# EAGLE design Qwiic Shield for RaspberryPi (EAGLE 7.5.0)
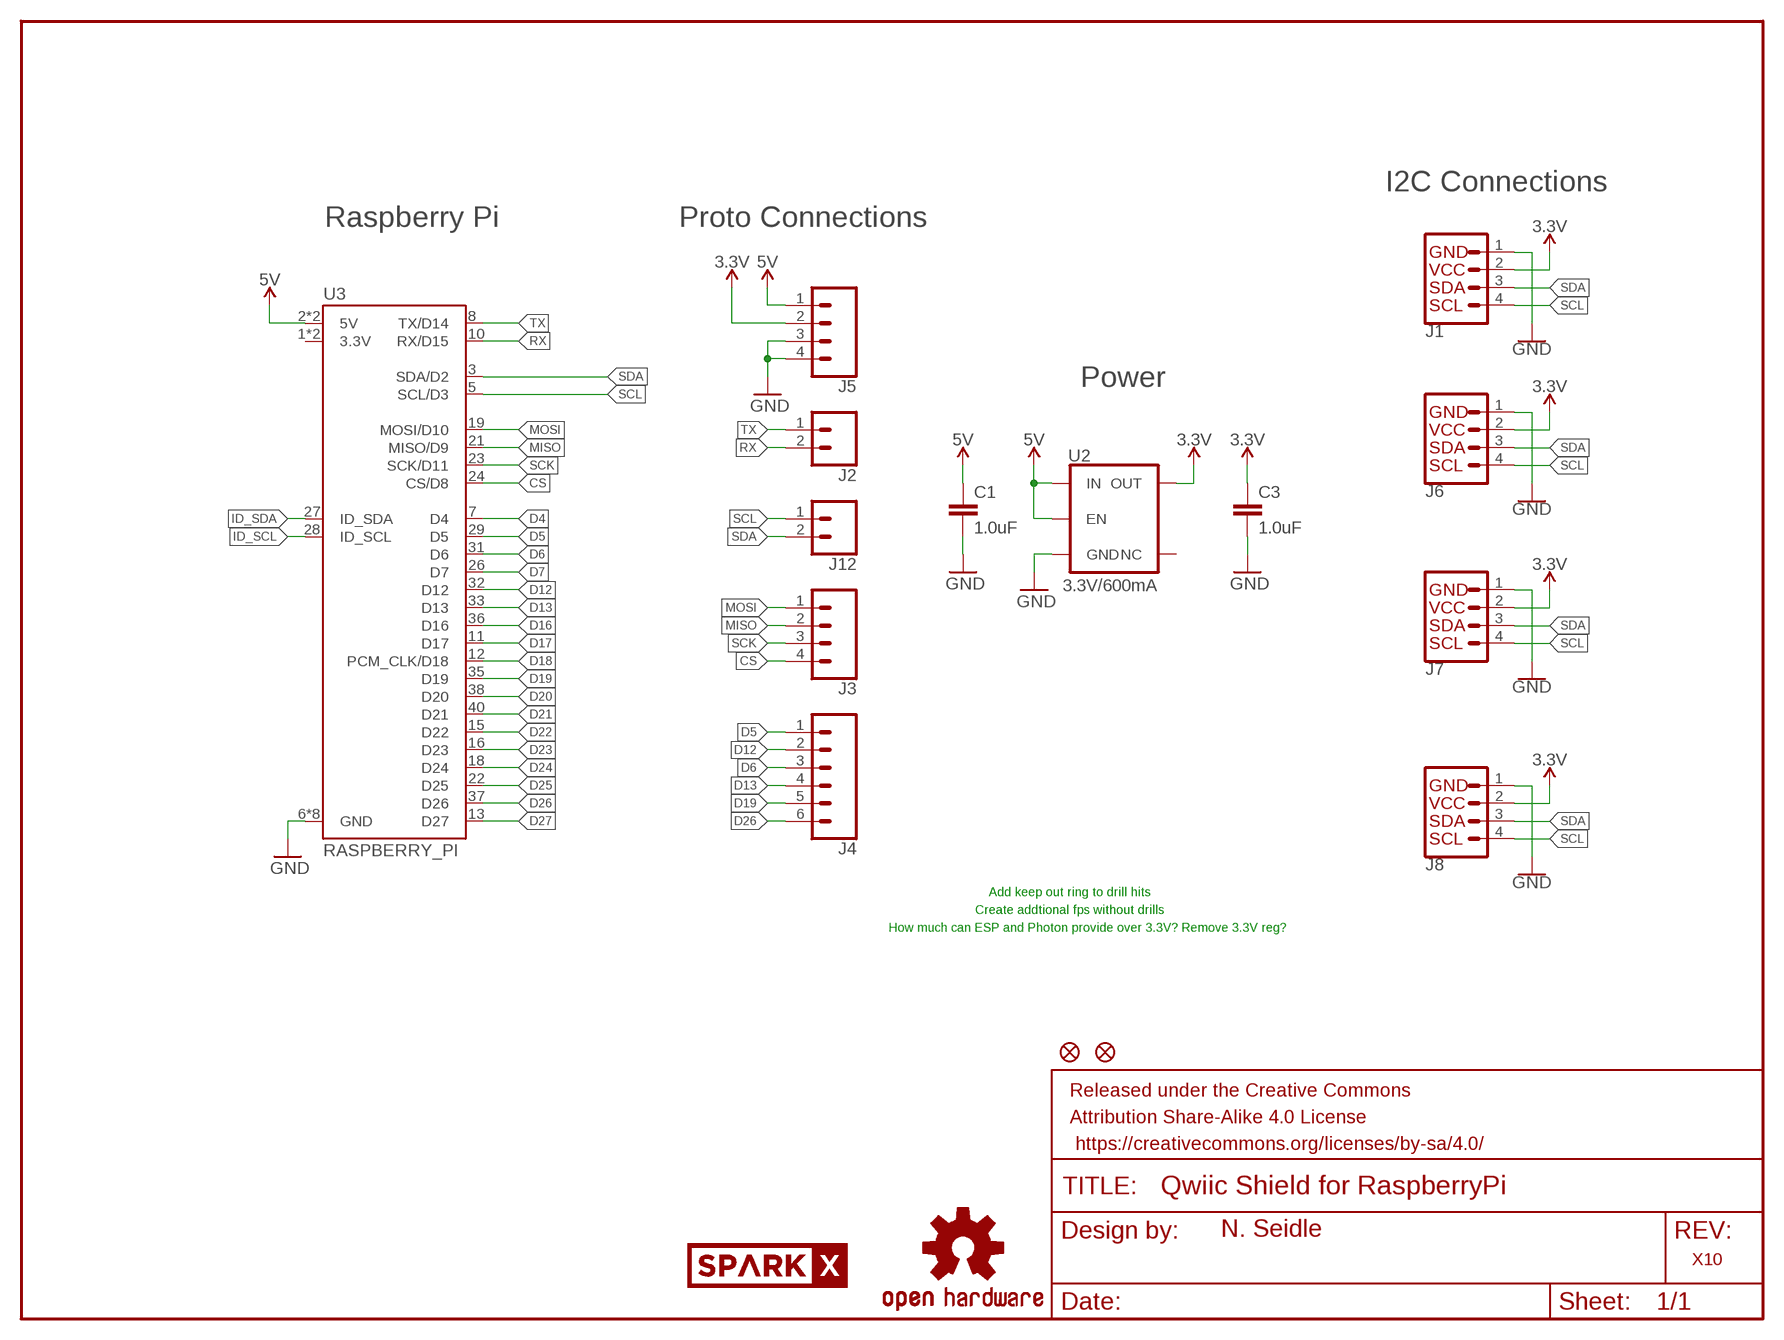
[diagram p0: schematic, sheet 1]

## Parts
C1  1.0uF  1.0UF-0603-16V-10%  [0603]
C3  1.0uF  1.0UF-0603-16V-10%  [0603]
FD1  FIDUCIAL1X2  [FIDUCIAL-1X2]
FD2  FIDUCIAL1X2  [FIDUCIAL-1X2]
FRAME1  FRAME-LETTER  [CREATIVE_COMMONS]
J1  I2C_STANDARDJS-1MM  [1X04_1MM_RA]
J2  CONN_021X02_NO_SILK  [1X02_NO_SILK]
J3  CONN_041X04_NO_SILK  [1X04_NO_SILK]
J4  CONN_06NO_SILK_FEMALE_PTH  [1X06_NO_SILK]
J5  CONN_041X04_NO_SILK  [1X04_NO_SILK]
J6  I2C_STANDARDJS-1MM  [1X04_1MM_RA]
J7  I2C_STANDARDJS-1MM  [1X04_1MM_RA]
J8  I2C_STANDARDJS-1MM  [1X04_1MM_RA]
J12  CONN_021X02_NO_SILK  [1X02_NO_SILK]
LOGO1  OSHW-LOGOMINI  [OSHW-LOGO-MINI]
U2  3.3V/600mA  V_REG_AP2112K-3.3V  [SOT23-5]
U3  RASPBERRY_PI  RASPBERRY_PI_40SMD  [RASPBERRY_PI_SHIELD_HOLES]
U$1  SPARKX-LOGO3  [SPARKX-SMALL]
U$2  SPARKX-LOGO5  [SPARKX-LARGE]

## Nets
3.3V: C3.1 J1.2(VCC) J5.2 J6.2(VCC) J7.2(VCC) J8.2(VCC) U2.5(OUT)
5V: C1.1 J5.1 U2.1(IN) U2.3(EN) U3.2(5V) U3.4(5V)
CS: J3.4 U3.24(CS/D8)
D4: U3.7(D4)
D5: J4.1 U3.29(D5)
D6: J4.3 U3.31(D6)
D7: U3.26(D7)
D12: J4.2 U3.32(D12)
D13: J4.4 U3.33(D13)
D16: U3.36(D16)
D17: U3.11(D17)
D18: U3.12(PCM_CLK/D18)
D19: J4.5 U3.35(D19)
D20: U3.38(D20)
D21: U3.40(D21)
D22: U3.15(D22)
D23: U3.16(D23)
D24: U3.18(D24)
D25: U3.22(D25)
D26: J4.6 U3.37(D26)
D27: U3.13(D27)
GND [vcc]: C1.2 C3.2 J1.1(GND) J5.3 J5.4 J6.1(GND) J7.1(GND) J8.1(GND) U2.2(GND) U3.6(GND) U3.9(GND) U3.14(GND) U3.20(GND) U3.25(GND) U3.30(GND) U3.34(GND) U3.39(GND)
ID_SCL: U3.28(ID_SCL)
ID_SDA: U3.27(ID_SDA)
MISO: J3.2 U3.21(MISO/D9)
MOSI: J3.1 U3.19(MOSI/D10)
RX: J2.2 U3.10(RX/D15)
SCK: J3.3 U3.23(SCK/D11)
SCL: J1.4(SCL) J6.4(SCL) J7.4(SCL) J8.4(SCL) J12.1 U3.5(SCL/D3)
SDA: J1.3(SDA) J6.3(SDA) J7.3(SDA) J8.3(SDA) J12.2 U3.3(SDA/D2)
TX: J2.1 U3.8(TX/D14)
Unconnected: U2.4(NC) U3.1(3.3V) U3.17(3.3V)

## Notes on the sheet
- I2C Connections
- Raspberry Pi | Proto Connections
- Power
- Add keep out ring to drill hits
- Create addtional fps without drills
- How much can ESP and Photon provide over 3.3V? Remove 3.3V reg?
- N. Seidle
- X10

## Library data of the parts
C1 C3 = SparkFun-Capacitors:1.0UF: 1µF ceramic capacitors A capacitor is a passive two-terminal electrical component used to store electrical energy temporarily in an electric field.; PROD_ID: CAP-00868
FD1 FD2 = SparkFun-Aesthetics:FIDUCIAL: Fiducial Alignment Points Various fiducial points for machine vision alignment.
FRAME1 = SparkFun-Aesthetics:FRAME-LETTER: Schematic Frame Standard 8.5x11 US Letter frame
J1 J6-J8 = SparkX:I2C_STANDARD: SparkFun I2C Standard Pinout Header SparkFun has standardized on a pinout for all I2C based sensor breakouts. This pinout allows I2C boards to be plugged directly into the headers on Arduino Uno compatible boards, and to be daisy chained easily. Example SparkFun Products: SparkFun Atmospheric Sensor Breakout - BME280 <https://www.sparkfun.com/products/13676> SparkFun Altitude/Pressure Sensor Breakout - MPL3115A2 <https://www.sparkfun.com/products/11084> SparkFun TOF Range Finder Sensor - VL6180 <https://www.sparkfun.com/products/12785>
J2 J12 = SparkFun-Connectors:CONN_02: Multi connection point. Often used as Generic Header-pin footprint for 0.1 inch spaced/style header connections On any of the 0.1 inch spaced packages, you can populate with these: Break Away Headers - Straight <https://www.sparkfun.com/products/116> (PRT-00116) Break Away Male Headers - Right Angle <https://www.sparkfun.com/products/553> (PRT-00553) Female Headers <https://www.sparkfun.com/products/115> (PRT-00115) Break Away Headers - Machine Pin <https://www.sparkfun.com/products/117> (PRT-00117) Break Away Female Headers - Swiss Machine Pin <https://www.sparkfun.com/products/743> (PRT-00743) For SCREWTERMINALS and SPRING TERMINALS visit here: Screw Terimnals on SparkFun.com <https://www.sparkfun.com/search/results?term=Screw+Terminals> (5mm/3.5mm/2.54mm spacing) This device is also useful as a general connection point to wire up your design to another part of your project. Our various solder wires solder well into these plated through hole pads. Hook-Up Wire - Assortment (Stranded, 22 AWG) <https://www.sparkfun.com/products/11375> (PRT-11375) Hook-Up Wire - Assortment (Solid Core, 22 AWG) <https://www.sparkfun.com/products/11367> (PRT-11367) View the entire wire category on our website here <https://www.sparkfun.com/categories/141> Special notes: Molex polarized connector foot print use with: PRT-08233 with associated crimp pins and housings. 2.54_SCREWTERM for use with PRT-10571. 3.5mm Screw Terminal footprints for PRT-08084 5mm Screw Terminal footprints for use with PRT-08432
J3 J5 = SparkFun-Connectors:CONN_04: Multi connection point. Often used as Generic Header-pin footprint for 0.1 inch spaced/style header connections On any of the 0.1 inch spaced packages, you can populate with these: Break Away Headers - Straight <https://www.sparkfun.com/products/116> (PRT-00116) Break Away Male Headers - Right Angle <https://www.sparkfun.com/products/553> (PRT-00553) Female Headers <https://www.sparkfun.com/products/115> (PRT-00115) Break Away Headers - Machine Pin <https://www.sparkfun.com/products/117> (PRT-00117) Break Away Female Headers - Swiss Machine Pin <https://www.sparkfun.com/products/743> (PRT-00743) For SCREWTERMINALS and SPRING TERMINALS visit here: Screw Terimnals on SparkFun.com <https://www.sparkfun.com/search/results?term=Screw+Terminals> (5mm/3.5mm/2.54mm spacing) This device is also useful as a general connection point to wire up your design to another part of your project. Our various solder wires solder well into these plated through hole pads. Hook-Up Wire - Assortment (Stranded, 22 AWG) <https://www.sparkfun.com/products/11375> (PRT-11375) Hook-Up Wire - Assortment (Solid Core, 22 AWG) <https://www.sparkfun.com/products/11367> (PRT-11367) View the entire wire category on our website here <https://www.sparkfun.com/categories/141> Special notes: Molex polarized connector foot print use with SKU : PRT-08231 with associated crimp pins and housings. 1MM SMD Version SKU: PRT-10208; PROD_ID: CONN-09696
J4 = SparkFun-Connectors:CONN_06: Multi connection point. Often used as Generic Header-pin footprint for 0.1 inch spaced/style header connections On any of the 0.1 inch spaced packages, you can populate with these: Break Away Headers - Straight <https://www.sparkfun.com/products/116> (PRT-00116) Break Away Male Headers - Right Angle <https://www.sparkfun.com/products/553> (PRT-00553) Female Headers <https://www.sparkfun.com/products/115> (PRT-00115) Break Away Headers - Machine Pin <https://www.sparkfun.com/products/117> (PRT-00117) Break Away Female Headers - Swiss Machine Pin <https://www.sparkfun.com/products/743> (PRT-00743) Arduino Stackable Header - 6 Pin <https://www.sparkfun.com/products/9280> (PRT-09280) For SCREWTERMINALS and SPRING TERMINALS visit here: Screw Terimnals on SparkFun.com <https://www.sparkfun.com/search/results?term=Screw+Terminals> (5mm/3.5mm/2.54mm spacing) This device is also useful as a general connection point to wire up your design to another part of your project. Our various solder wires solder well into these plated through hole pads. Hook-Up Wire - Assortment (Stranded, 22 AWG) <https://www.sparkfun.com/products/11375> (PRT-11375) Hook-Up Wire - Assortment (Solid Core, 22 AWG) <https://www.sparkfun.com/products/11367> (PRT-11367) View the entire wire category on our website here <https://www.sparkfun.com/categories/141>; PROD_ID: CONN-08437
LOGO1 = SparkFun-Aesthetics:OSHW-LOGO: Open Source Hardware Logo This logo indicates the piece of hardware it is found on incorporates a OSHW license and/or adheres to the definition of open source hardware found here: http://freedomdefined.org/OSHW
U2 = SparkFun-IC-Power:V_REG_AP2112: AP2112 - 600mA CMOS LDO Regulator w/ Enable The AP2112 is CMOS process low dropout linear regulator with enable function, the regulator delivers a guaranteed 600mA (min.) continuous load current. Features Output Voltage Accuracy: ±1.5% Output Current: 600mA (Min.) Foldback Short Current Protection: 50mA Enable Function to Turn ON/OFF VOUT Low Dropout Voltage (3.3V): 250mV (Typ.) @IOUT=600mA Excellent Load Regulation: 0.2%/A (Typ.) Excellent Line Regulation: 0.02%/V (Typ.) Low Quiescent Current: 55μA (Typ.) Low Standby Current: 0.01μA (Typ.) Low Output Noise: 50μVRMS PSRR: 100Hz -65dB, 1kHz -65dB OTSD Protection Stable with 1.0μF Flexible Cap: Ceramic, Tantalum and Aluminum Electrolytic Operation Temperature Range: -40°C to 85°C ESD: MM 400V, HBM 4000V; PROD_ID: VREG-12457; VALUE: 3.3V
U3 = SparkX:RASPBERRY_PI_40
U$1 U$2 = SparkX:SPARKX-LOGO

## Net classes
0 Default: width 0.178 mm
1 vcc: width 0.178 mm

## Board
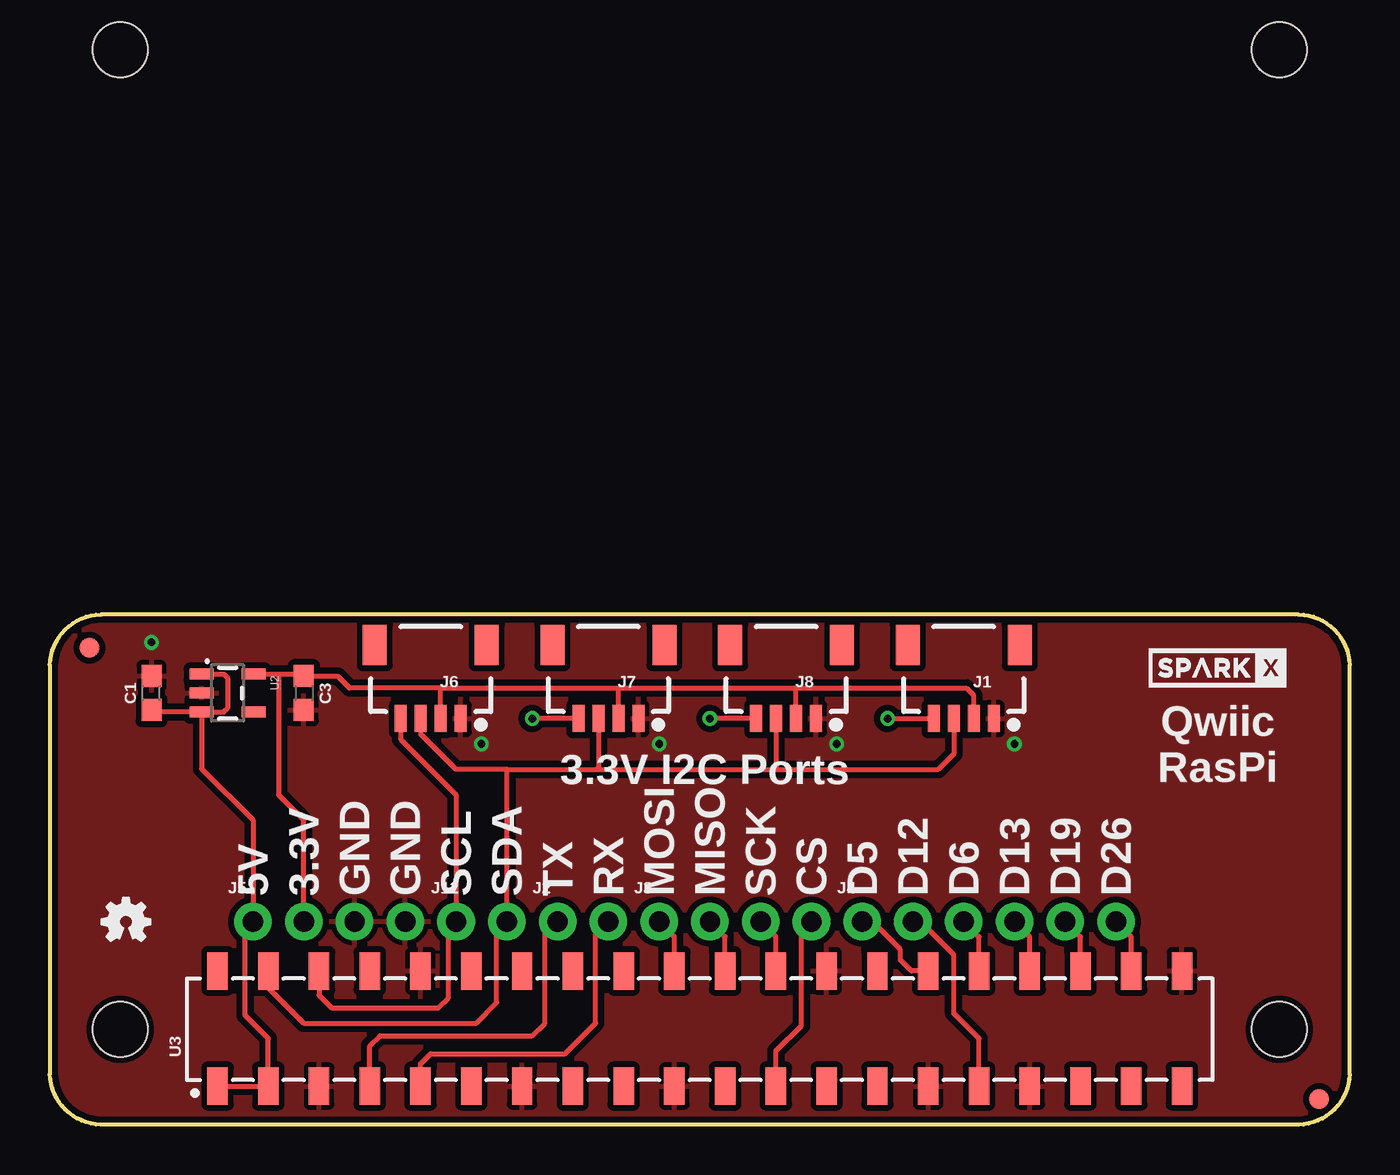
[diagram p1: board, top side]
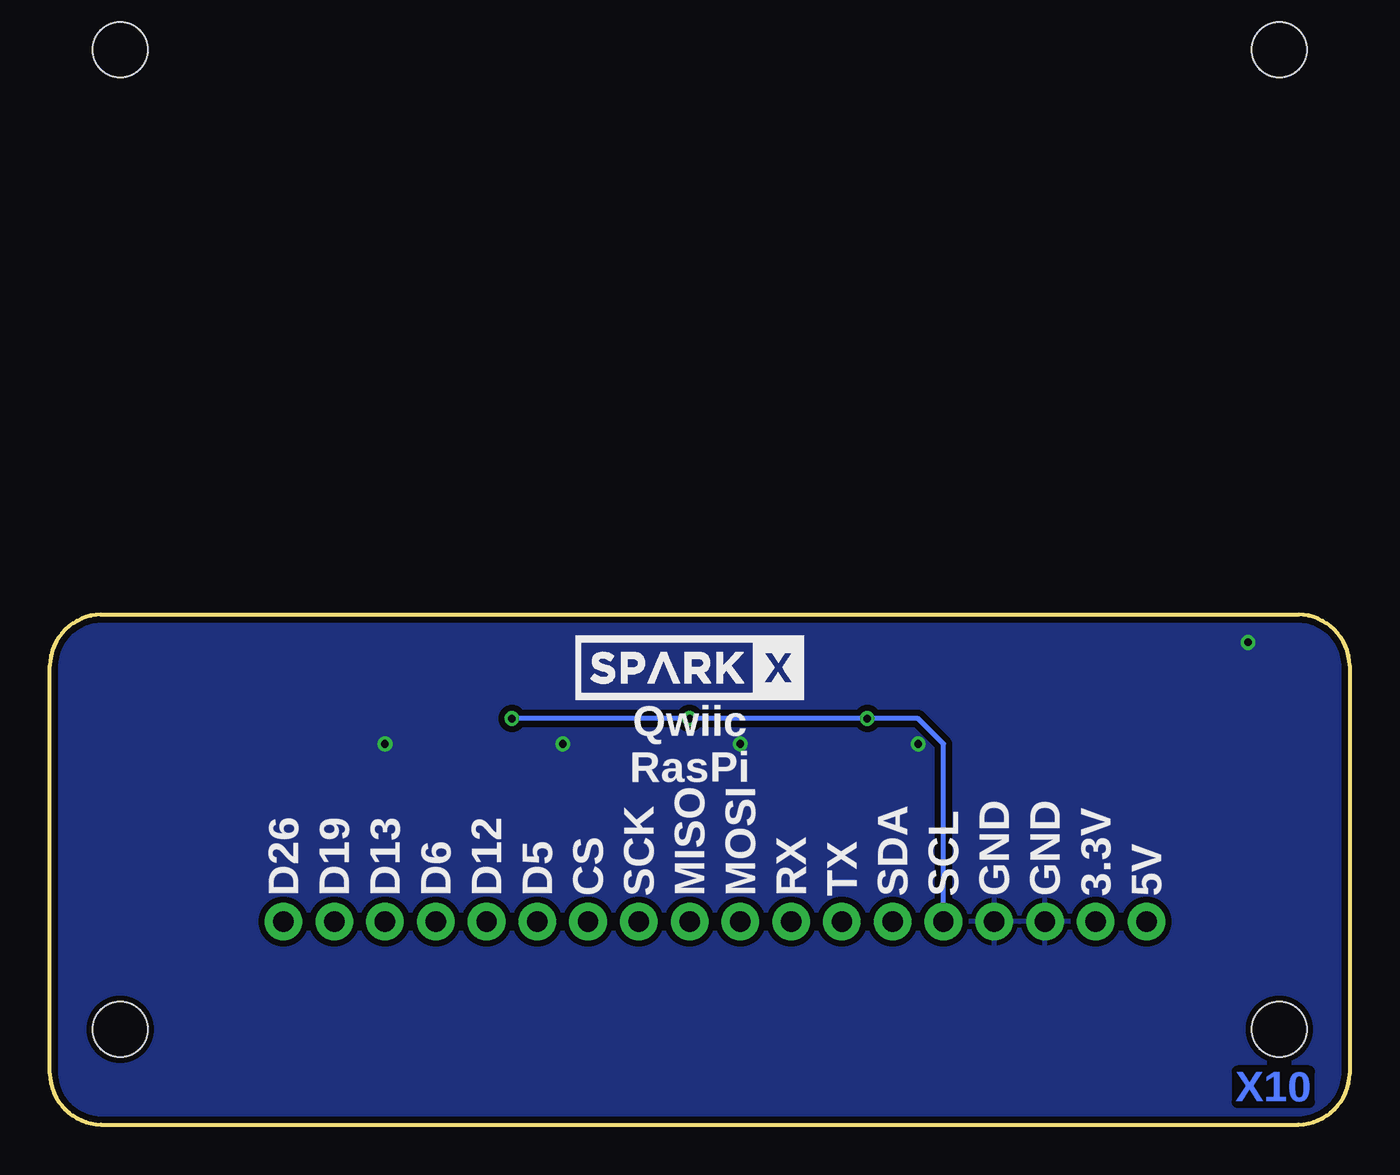
[diagram p2: board, bottom side, seen from below]

Size 65.02 x 25.53 mm. Coordinates in mm from the lower left corner, seen from the top.
Outline: 0,22.99 0,2.54 arc87 2.54,0 62.48,0 arc87 65.02,2.54 65.02,22.99 arc87 62.48,25.53 2.54,25.53 arc87 0,22.99
Copper layers (1*16): Top 0.035mm / dielectric 1.5mm / Bottom 0.035mm
Design rules "SparkFun-2-layer-TIGHT *": minimum track width 7mil, minimum drill 15mil, track to track 6mil, track to pad 6mil, pad to pad 6mil, via to via 6mil, smd to smd 6mil, copper to edge 7mil, drill to drill 7mil, minimum pad ring 7mil, minimum via ring 7mil, stop-mask expansion 4mil, vias tented up to drill 25mil, thermal gap 10mil

### Footprints (pad centres in the part's own frame; a part is rotated, then mirrored left to right if it is on the bottom)
0603 = smd 1.1 x 1: 1 -0.85,0; 2 0.85,0
FIDUCIAL-1X2 = smd 1 x 1: 1 0,0
1X04_1MM_RA = smd 0.6 x 1.35: 1 -1.5,0; 2 -0.5,0; 3 0.5,0; 4 1.5,0 | smd 1.2 x 2: NC1 2.8,-3.675; NC2 -2.8,-3.675
1X02_NO_SILK = drill 1.016 pad 1.88: 1 0,0; 2 2.54,0
1X04_NO_SILK = drill 1.016 pad 1.88: 1 0,0; 2 2.54,0; 3 5.08,0; 4 7.62,0
1X06_NO_SILK = drill 1.016 pad 1.88: 1 0,0; 2 2.54,0; 3 5.08,0; 4 7.62,0; 5 10.16,0; 6 12.7,0
SOT23-5 = smd 0.55 x 1.2: 1 -0.95,-1.3; 2 0,-1.3; 3 0.95,-1.3; 4 0.95,1.3; 5 -0.95,1.3
RASPBERRY_PI_SHIELD_HOLES = smd 1.02 x 1.87: 1 8.382,7.686; 2 8.382,1.929; 3 10.922,7.686; 4 10.922,1.929; 5 13.462,7.686; 6 13.462,1.929; 7 16.002,7.686; 8 16.002,1.929; 9 18.542,7.686; 10 18.542,1.929; 11 21.082,7.686; 12 21.082,1.929; 13 23.622,7.686; 14 23.622,1.929; 15 26.162,7.686; 16 26.162,1.929; 17 28.702,7.686; 18 28.702,1.929; 19 31.242,7.686; 20 31.242,1.929; 21 33.782,7.686; 22 33.782,1.929; 23 36.322,7.686; 24 36.322,1.929; 25 38.862,7.686; 26 38.862,1.929; 27 41.402,7.686; 28 41.402,1.929; 29 43.942,7.686; 30 43.942,1.929; 31 46.482,7.686; 32 46.482,1.929; 33 49.022,7.686; 34 49.022,1.929; 35 51.562,7.686; 36 51.562,1.929; 37 54.102,7.686; 38 54.102,1.929; 39 56.642,7.686; 40 56.642,1.929 | hole 2.75: 3.512,4.775; 61.512,4.775; 61.512,53.775; 3.512,53.775

### Placement (x,y rotation side)
C1  5.08,21.59 90 top
C3  12.7,21.59 270 top
FD1  1.97,23.86 180 top
FD2  63.5,1.27 180 top
FRAME1  -8.89,-24.13 0 top  (outside the outline)
J1  45.72,20.32 180 top
J2  25.4,10.16 0 top
J3  30.48,10.16 0 top
J4  40.64,10.16 0 top
J5  10.16,10.16 0 top
J6  19.05,20.32 180 top
J7  27.94,20.32 180 top
J8  36.83,20.32 180 top
J12  20.32,10.16 0 top
LOGO1  3.81,10.16 0 top
U2  8.89,21.59 270 top
U3  0,0 0 top
U$1  58.42,22.86 0 top
U$2  33.02,22.86 0 bottom

### Tracks (layer width: path | path; a pad name or v marks a point on that pad's centre or on a via)
3.3V
  Top 0.254: U2.5 11.43,22.54 | 11.43,22.54 12.6,22.54 C3.1 14.39,22.44 14.99,21.84 19.56,21.84 | 19.56,21.84 28.45,21.84 | 28.45,21.84 37.34,21.84 | 37.34,21.84 45.85,21.84 46.22,21.47 J1.2 | J8.2 37.33,21.84 37.34,21.84 | J7.2 28.44,21.84 28.45,21.84 | J6.2 19.55,21.84 19.56,21.84 | J5.2 12.7,15.24 11.43,16.51 11.43,22.54
5V
  Top 0.254: U3.2 U3.4 10.92,4.32 9.78,5.46 9.78,9.78 J5.1 10.16,15.24 7.59,17.81 U2.3 | U2.1 8.7,22.54 8.89,22.35 8.89,20.83 8.7,20.64 U2.3 | U2.3 5.18,20.64 C1.1
CS
  Top 0.254: U3.24 36.32,3.68 37.59,4.95 37.59,9.65 J3.4
D5
  Top 0.254: U3.29 43.11,7.69 42.55,8.26 42.55,8.76 41.15,10.16 J4.1
D6
  Top 0.254: U3.31 46.48,9.4 J4.3
D12
  Top 0.254: U3.32 46.48,4.32 45.21,5.59 45.21,8.51 43.56,10.16 J4.2
D13
  Top 0.254: U3.33 49.02,9.4 J4.4
D19
  Top 0.254: U3.35 51.56,9.4 J4.5
D26
  Top 0.254: U3.37 54.1,9.4 J4.6
GND  (via drill 0.38)
  other vias: 21.59,19.05 30.48,19.05 39.37,19.05 48.26,19.05 5.08,24.13
  pour Top (isolate 0.305): 0,25.4 66.04,25.4 66.04,0 0,0
  pour Bottom (isolate 0.305): 0,25.4 66.04,25.4 66.04,0 0,0
MISO
  Top 0.254: U3.21 33.78,9.4 J3.2
MOSI
  Top 0.254: U3.19 31.24,9.4 J3.1
RX
  Top 0.254: U3.10 18.54,3.05 19.05,3.56 25.78,3.56 27.3,5.08 27.3,9.53 J2.2
SCK
  Top 0.254: U3.23 36.32,9.4 J3.3
SCL  (via drill 0.38)
  Top 0.254: U3.5 13.46,6.48 14.1,5.84 19.43,5.84 19.94,6.35 19.94,9.78 J12.1 20.32,16.51 17.55,19.28 J6.4 | J7.4 v24.13,20.32 | v41.91,20.32 J1.4 | J1.4 | J8.4 v33.02,20.32
  Bottom 0.254: J12.1 20.32,19.05 21.59,20.32 v24.13,20.32 v33.02,20.32 v41.91,20.32
SDA
  Top 0.254: U3.3 10.92,6.86 12.7,5.08 21.34,5.08 22.35,6.1 22.35,9.65 J12.2 22.86,17.78 | J6.3 18.55,19.55 20.32,17.78 22.86,17.78 | 22.86,17.78 27.56,17.78 | 27.56,17.78 36.32,17.78 | 36.32,17.78 44.45,17.78 45.22,18.55 J1.3 | J8.3 36.33,17.79 36.32,17.78 | J7.3 27.44,17.9 27.56,17.78
TX
  Top 0.254: U3.8 16,3.94 16.51,4.45 24.13,4.45 24.77,5.08 24.77,9.53 J2.1

### Text on the board
Bottom: X10
tPlace: Qwiic / RasPi | 3.3V I2C Ports | 5V | 3.3V | GND | GND | SCL | SDA | TX | RX | MOSI | MISO | SCK | CS | D5 | D12 | D6 | D13 | D19 | D26
bPlace: Qwiic / RasPi | 5V | 3.3V | GND | GND | SCL | SDA | TX | RX | MOSI | MISO | SCK | CS | D5 | D12 | D6 | D13 | D19 | D26
tDocu: N. Seidle